# EAGLE design SparkFun_6DoF_ISM330DHCX_Micro (EAGLE 9.6.2)
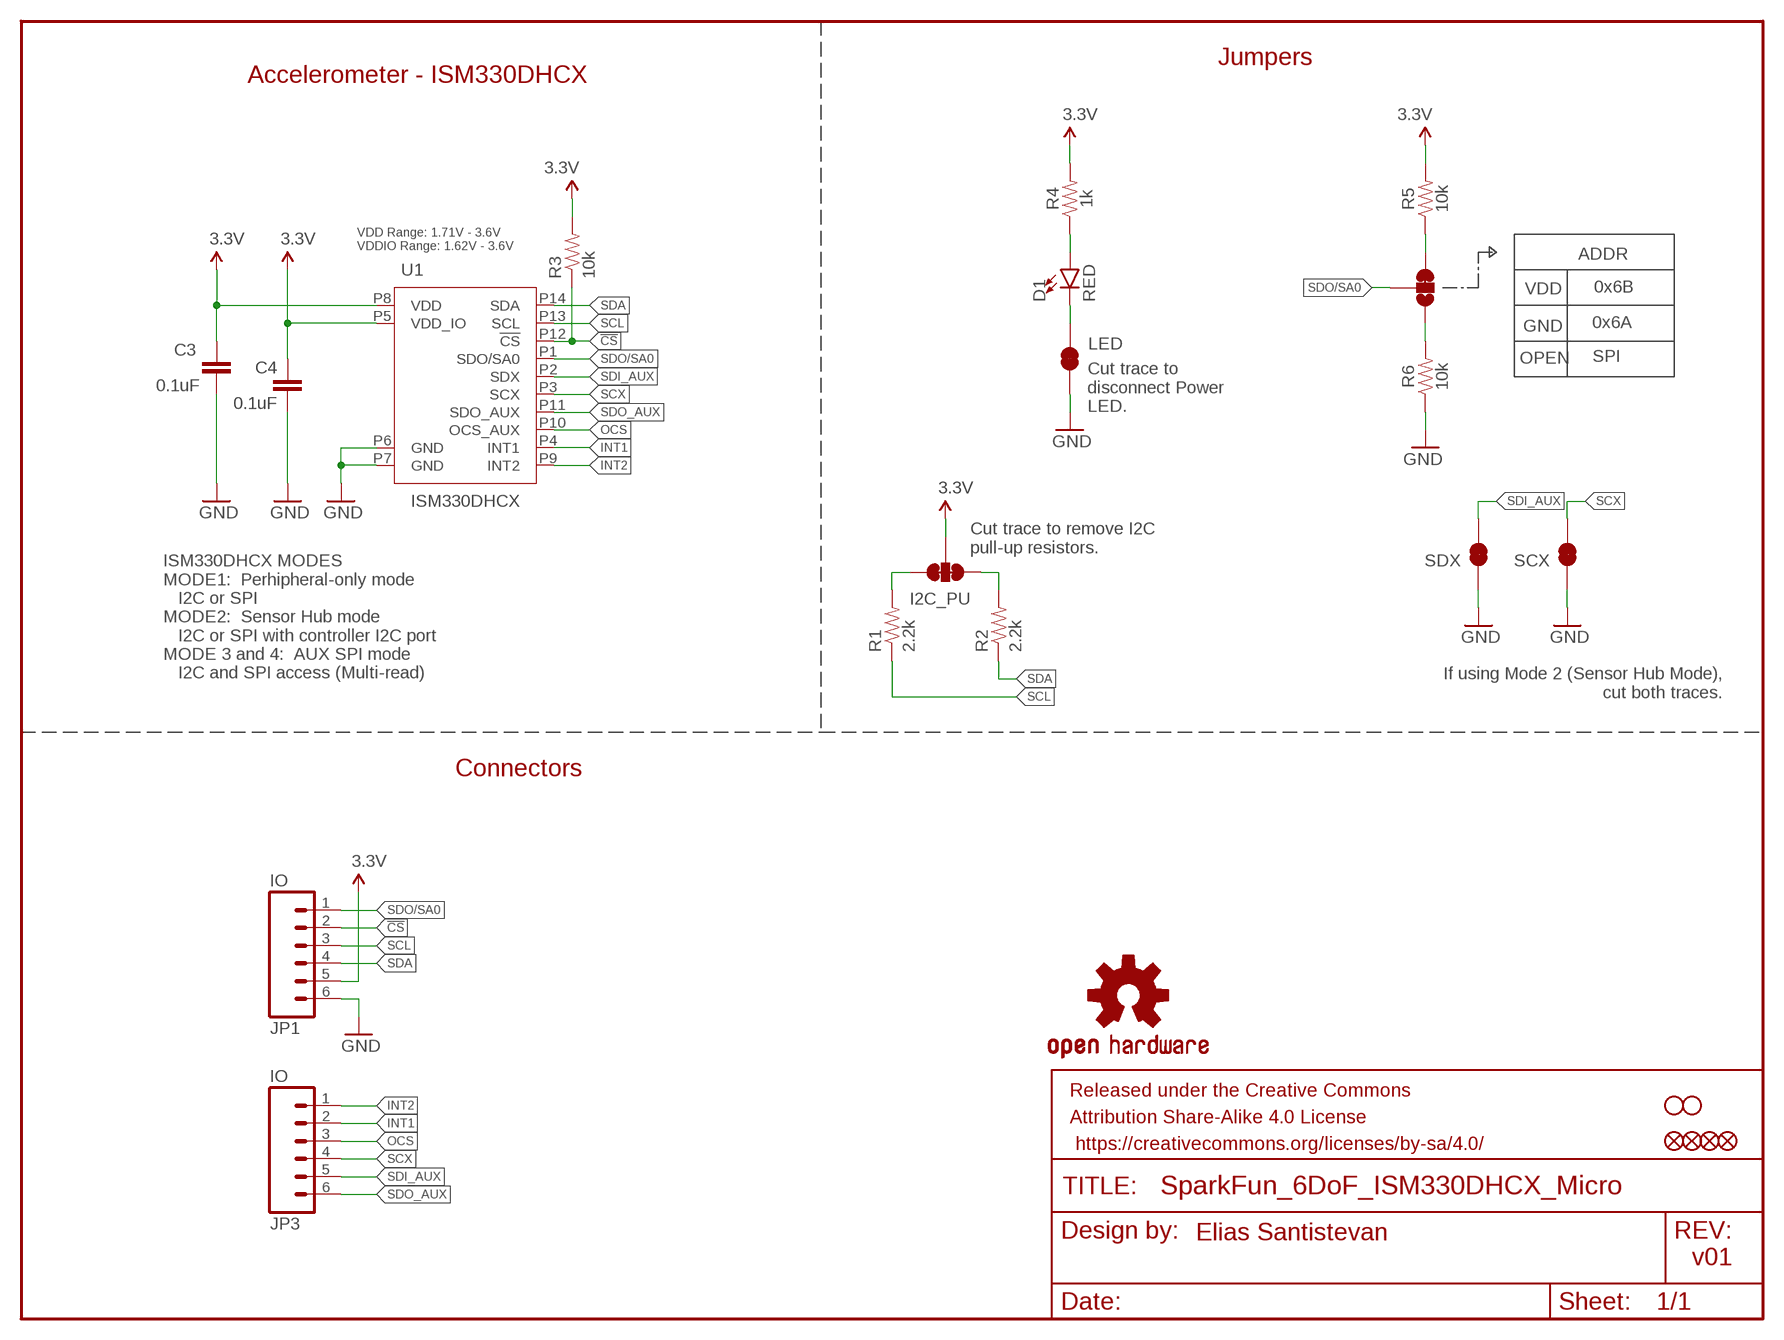
[diagram p0: schematic, sheet 1]

## Parts
ADDR  JUMPER-SMT_3_1-NC_TRACE_SILK  [SMT-JUMPER_3_1-NC_TRACE_SILK]
C3  0.1uF  0.1UF-0402T-6.3V-10%-X7R  [0402-TIGHT]
C4  0.1uF  0.1UF-0402T-6.3V-10%-X7R  [0402-TIGHT]
D1  RED  LED-RED0603  [LED-0603]
FD1  FIDUCIALUFIDUCIAL  [FIDUCIAL-MICRO]
FD2  FIDUCIALUFIDUCIAL  [FIDUCIAL-MICRO]
FID1  FIDUCIALUFIDUCIAL  [FIDUCIAL-MICRO]
FID2  FIDUCIALUFIDUCIAL  [FIDUCIAL-MICRO]
FRAME1  FRAME-LETTER  [CREATIVE_COMMONS]
I2C_PU  S_MODE  JUMPER-SMT_3_2-NC_TRACE_SILK  [SMT-JUMPER_3_2-NC_TRACE_SILK]
JP1  IO  CONN_06NO_SILK_NO_POP  [1X06_NO_SILK]
JP3  IO  CONN_06NO_SILK_NO_POP  [1X06_NO_SILK]
LED  JUMPER-SMT_2_NC_TRACE_SILK  [SMT-JUMPER_2_NC_TRACE_SILK]
LOGO2  OSHW-LOGOMINI  [OSHW-LOGO-MINI]
R1  2.2k  2.2KOHM-0402T-1/16W-1%  [0402-TIGHT]
R2  2.2k  2.2KOHM-0402T-1/16W-1%  [0402-TIGHT]
R3  10k  10KOHM-0402T-1/16W-1%  [0402-TIGHT]
R4  1k  1KOHM-0402T-1/16W-1%  [0402-TIGHT]
R5  10k  10KOHM-0402T-1/16W-1%  [0402-TIGHT]
R6  10k  10KOHM-0402T-1/16W-1%  [0402-TIGHT]
SCX  JUMPER-SMT_2_NC_TRACE_SILK  [SMT-JUMPER_2_NC_TRACE_SILK]
SDX  JUMPER-SMT_2_NC_TRACE_SILK  [SMT-JUMPER_2_NC_TRACE_SILK]
STANDOFF1  STAND-OFFTIGHT  [STAND-OFF-TIGHT]
STANDOFF2  STAND-OFFTIGHT  [STAND-OFF-TIGHT]
U1  ISM330DHCX  [LGA-14L]

## Nets
3.3V: C3.1 C4.1 I2C_PU.2 JP1.5 R3.2 R4.2 R5.2 U1.P5(VDD_IO) U1.P8(VDD)
!CS!: JP1.2 R3.1 U1.P12(!CS!)
GND: C3.2 C4.2 JP1.6 LED.1 R6.1 SCX.1 SDX.1 U1.P6(GND) U1.P7(GND)
INT1: JP3.2 U1.P4(INT1)
INT2: JP3.1 U1.P9(INT2)
N$1: ADDR.3 R5.1
N$2: D1.A R4.1
N$3: D1.C LED.2
N$5: I2C_PU.1 R1.2
N$6: I2C_PU.3 R2.2
N$7: ADDR.1 R6.2
OCS: JP3.3 U1.P10(OCS_AUX)
SCL: JP1.3 R1.1 U1.P13(SCL)
SCX: JP3.4 SCX.2 U1.P3(SCX)
SDA: JP1.4 R2.1 U1.P14(SDA)
SDI_AUX: JP3.5 SDX.2 U1.P2(SDX)
SDO/SA0: ADDR.2 JP1.1 U1.P1(SDO/SA0)
SDO_AUX: JP3.6 U1.P11(SDO_AUX)

## Notes on the sheet
- Jumpers
- Accelerometer - ISM330DHCX
- VDD Range: 1.71V - 3.6V
  VDDIO Range: 1.62V - 3.6V
- VDD | 0x6B
- GND | 0x6A
- OPEN | SPI
- Cut trace to
  disconnect Power
  LED.
- Cut trace to remove I2C
  pull-up resistors.
- ISM330DHCX MODES
  MODE1:  Perhipheral-only mode
     I2C or SPI
  MODE2:  Sensor Hub mode
     I2C or SPI with controller I2C port
  MODE 3 and 4:  AUX SPI mode
     I2C and SPI access (Multi-read)
- If using Mode 2 (Sensor Hub Mode), 
  cut both traces.
- Connectors
- Elias Santistevan
- v01

## Library data of the parts
ADDR = SparkFun-Jumpers:JUMPER-SMT_3_1-NC_TRACE: Normally closed trace jumper (1 of 2 connections) This jumper has a trace between two pads so it's normally closed (NC). The other connection is normally open (NO). Use a razor knife to open the connection. For best results follow the IPC guidelines for cutting traces: Cutout at least 0.063 mm (0.005 in). Remove all loose material to clean up the cut area. Seal the cut with an approved epoxy. Reapply solder to reclose the connection, or to close the NO connection.
C3 C4 = SparkFun-Capacitors:0.1UF: 0.1µF ceramic capacitors A capacitor is a passive two-terminal electrical component used to store electrical energy temporarily in an electric field.; PROD_ID: CAP-14993
D1 = SparkFun-LED:LED-RED: Red SMD LED Used in manufacturing of most products at SparkFun Packages: 0603 - SMD 0603 package [Product Link] <http://docs.avagotech.com/docs/AV02-0551EN> 0603 SMART - SMD 0603 SMART package ( more efficient and expensive)[Product Link] <http://www.osram-os.com/Graphics/XPic2/00077099_0.pdf> 1206 - SMD1206 package [Product Link] <https://www.sparkfun.com/datasheets/DevTools/LilyPad/Q150OVS4.pdff> SparkFun Products: Pro Mini 328 -5V <https://www.sparkfun.com/products/821> RedBoard <https://www.sparkfun.com/products/12757> IOIO-OTG <https://www.sparkfun.com/products/13613>; PROD_ID: DIO-00819
FD1 FD2 FID1 FID2 = SparkFun-Aesthetics:FIDUCIAL: Fiducial Alignment Points Point-of-reference for pick-and-place machines and other optical instruments.
FRAME1 = SparkFun-Aesthetics:FRAME-LETTER: Schematic Frame - Letter Standard 8.5x11 US Letter frame; DESIGNER: Elias Santistevan
I2C_PU = SparkFun-Jumpers:JUMPER-SMT_3_2-NC_TRACE: Normally closed trace jumper (2 of 2 connections) This jumper has a trace between all three pads so they are normally closed (NC). Use a razor knife to open the connection(s). For best results follow the IPC guidelines for cutting traces: Cutout at least 0.063 mm (0.005 in). Remove all loose material to clean up the cut area. Seal the cut with an approved epoxy. Reapply solder to reclose the connection(s).
JP1 JP3 = SparkFun-Connectors:CONN_06: Multi connection point. Often used as Generic Header-pin footprint for 0.1 inch spaced/style header connections On any of the 0.1 inch spaced packages, you can populate with these: Break Away Headers - Straight <https://www.sparkfun.com/products/116> (PRT-00116) Break Away Male Headers - Right Angle <https://www.sparkfun.com/products/553> (PRT-00553) Female Headers <https://www.sparkfun.com/products/115> (PRT-00115) Break Away Headers - Machine Pin <https://www.sparkfun.com/products/117> (PRT-00117) Break Away Female Headers - Swiss Machine Pin <https://www.sparkfun.com/products/743> (PRT-00743) Arduino Stackable Header - 6 Pin <https://www.sparkfun.com/products/9280> (PRT-09280) For SCREWTERMINALS and SPRING TERMINALS visit here: Screw Terimnals on SparkFun.com <https://www.sparkfun.com/search/results?term=Screw+Terminals> (5mm/3.5mm/2.54mm spacing) This device is also useful as a general connection point to wire up your design to another part of your project. Our various solder wires solder well into these plated through hole pads. Hook-Up Wire - Assortment (Stranded, 22 AWG) <https://www.sparkfun.com/products/11375> (PRT-11375) Hook-Up Wire - Assortment (Solid Core, 22 AWG) <https://www.sparkfun.com/products/11367> (PRT-11367) View the entire wire category on our website here <https://www.sparkfun.com/categories/141>
LED SCX SDX = SparkFun-Jumpers:JUMPER-SMT_2_NC_TRACE: Normally closed trace jumper This jumper has a trace between two pads so it's normally closed (NC). Use a razor knife to open the connection. For best results follow the IPC guidelines for cutting traces: Cutout at least 0.063 mm (0.005 in). Remove all loose material to clean up the cut area. Seal the cut with an approved epoxy. Reapply solder to reclose the connection.
LOGO2 = SparkFun-Aesthetics:OSHW-LOGO: Open-Source Hardware (OSHW) Logo This logo indicates the piece of hardware it is found on incorporates a OSHW license and/or adheres to the definition of open source hardware found here: http://freedomdefined.org/OSHW
R1 R2 = SparkFun-Resistors:2.2KOHM: 2.2kΩ resistor A resistor is a passive two-terminal electrical component that implements electrical resistance as a circuit element. Resistors act to reduce current flow, and, at the same time, act to lower voltage levels within circuits. - Wikipedia; PROD_ID: RES-14341
R3 R5 R6 = SparkFun-Resistors:10KOHM: 10kΩ resistor A resistor is a passive two-terminal electrical component that implements electrical resistance as a circuit element. Resistors act to reduce current flow, and, at the same time, act to lower voltage levels within circuits. - Wikipedia; PROD_ID: RES-14241
R4 = SparkFun-Resistors:1KOHM: 1kΩ resistor A resistor is a passive two-terminal electrical component that implements electrical resistance as a circuit element. Resistors act to reduce current flow, and, at the same time, act to lower voltage levels within circuits. - Wikipedia; PROD_ID: RES-14342
STANDOFF1 STANDOFF2 = SparkFun-Hardware:STAND-OFF: Stand Off Drill holes for mechanically mounting via screws, standoffs, etc. Note: Use the keepout ring to avoid running the screw head into surrounding components. Variant Overviews STAND-OFF - Mechanical footprint for a #4 phillips button head screw. STAND-OFF-TIGHT - Mechanical footprint for a #4 phillips button head screw, Example SparkFun Products Screw - Phillips Head (1/4", 4-40, 10 pack) <https://www.sparkfun.com/products/10453> (PRT-10453) Screw - Phillips Head (1/2", 4-40, 10 pack) <https://www.sparkfun.com/products/10452> (PRT-10452) Screw - Phillips Head (3/4", 4-40, 10 pack) <https://www.sparkfun.com/products/10451> (PRT-10451) Screw - Phillips Head (1", 4-40, 10 pack) <https://www.sparkfun.com/products/10450> (PRT-10450)
U1 = ISM330DHCX:ISM330DHCX: ISM330DHCX 6DoF The ISM330DHCX is a system-in-package featuring a high-performance 3D digital accelerometer and 3D digital gyroscope tailored for Industry 4.0 applications.; PROD_ID: SEN-19472

## Board
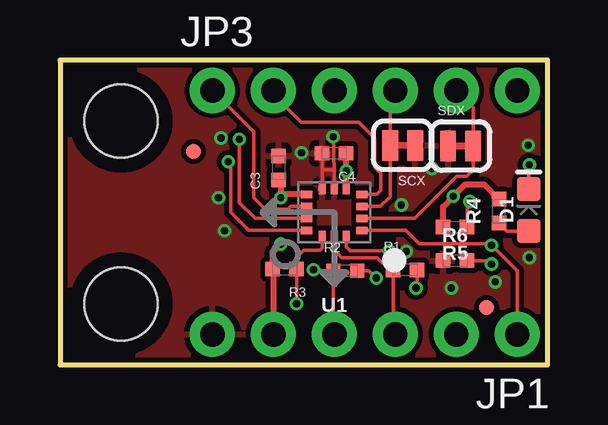
[diagram p1: board, top side]
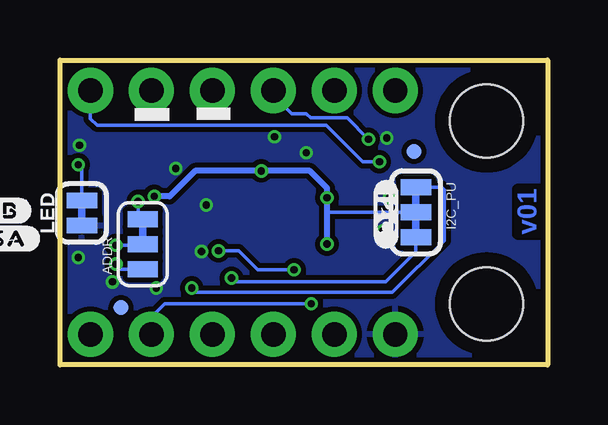
[diagram p2: board, bottom side, seen from below]

Size 20.32 x 12.7 mm. Coordinates in mm from the lower left corner, seen from the top.
Outline: 20.32,12.7 0,12.7 0,0 20.32,0 20.32,12.7
Copper layers (1*16): Top 0.035mm / dielectric 1.5mm / Bottom 0.035mm
Design rules "SparkFun-2-Layer-Minimum-JLCPCB": minimum track width 5mil, minimum drill 0.3mm, track to track 5mil, track to pad 5mil, pad to pad 5mil, via to via 5mil, smd to smd 5mil, copper to edge 7mil, drill to drill 7mil, minimum pad ring 5mil, minimum via ring 5mil, stop-mask expansion 2.5mil, vias tented up to drill 25mil, thermal gap 10mil
tRestrict: area 11.2,7.2 to 11.2,7.4; area 14.7,10 to 16.2,10.2

### Footprints (pad centres in the part's own frame; a part is rotated, then mirrored left to right if it is on the bottom)
SMT-JUMPER_3_1-NC_TRACE_SILK = smd 0.66 x 1.27: 1 -1.041,0; 2 0,0; 3 1.041,0
0402-TIGHT = smd 0.6 x 0.6: 1 -0.5,0; 2 0.5,0
LED-0603 = smd 1 x 1: A -0.877,0; C 0.877,0
FIDUCIAL-MICRO = smd 0.635 x 0.635: 1 0,0
SMT-JUMPER_3_2-NC_TRACE_SILK = smd 0.66 x 1.27: 1 -1.041,0; 2 0,0; 3 1.041,0
1X06_NO_SILK = drill 1.016 pad 1.88: 1 0,0; 2 2.54,0; 3 5.08,0; 4 7.62,0; 5 10.16,0; 6 12.7,0
SMT-JUMPER_2_NC_TRACE_SILK = smd 0.66 x 1.27: 1 -0.521,0; 2 0.521,0
STAND-OFF-TIGHT = hole 3.048: 0,0
LGA-14L = smd 0.48 x 0.3: P1 -1.163,0.75; P2 -1.163,0.25; P3 -1.163,-0.25; P4 -1.163,-0.75; P8 1.163,-0.75; P9 1.163,-0.25; P10 1.163,0.25; P11 1.163,0.75 | smd 0.3 x 0.48: P5 -0.5,-1; P6 0,-1; P7 0.5,-1; P12 0.5,1; P13 0,1; P14 -0.5,1

### Placement (x,y rotation side)
ADDR  16.87,5.03 90 bottom
C3  9.11,8.2 90 top
C4  11.42,8.81 180 top
D1  19.53,6.45 90 top
FD1  5.56,8.89 0 bottom
FD2  17.78,2.39 0 bottom
FID1  5.56,8.89 0 top
FID2  17.78,2.39 0 top
FRAME1  -19.05,-16.51 0 top  (outside the outline)
I2C_PU  5.49,6.35 270 bottom
JP1  19.05,1.27 180 top
JP3  6.35,11.43 0 top
LED  19.41,6.32 90 bottom
LOGO1  QWIIC_LOGO_4MM  [QWIIC_4MM]  32,3.25 0 top  (outside the outline)
LOGO2  31.39,8.36 0 bottom  (outside the outline)
LOGO3  SFE_LOGO_NAME_FLAME.1_INCH  [SFE_LOGO_NAME_FLAME_.1]  -9.85,7.71 270 bottom  (outside the outline)
R1  14.38,3.96 0 top
R2  11.89,3.92 0 top
R3  9.36,3.99 180 top
R4  18.29,6.4 90 top
R5  16.46,5.74 180 top
R6  16.46,4.34 0 top
SCX  14.27,9.14 180 top
SDX  16.69,9.12 0 top
STANDOFF1  2.54,10.16 0 top
STANDOFF2  2.54,2.54 0 top
U1  11.43,6.35 180 top
U$1  [#3V3#1]  26.67,25.55 90 top  (outside the outline)
U$2  [#GND#0]  24.16,25.58 90 top  (outside the outline)
U$3  [##CS##7]  36.86,24.94 90 top  (outside the outline)
U$4  [#SDA#4]  29.21,25.55 90 top  (outside the outline)
U$5  [#SCL#5]  31.78,25.4 90 top  (outside the outline)
U$6  [#SDO#6]  34.32,25.53 90 top  (outside the outline)
U$7  [#INT1#9]  8.86,26.47 90 top  (outside the outline)
U$8  [#INT2#9]  6.32,26.34 90 top  (outside the outline)
U$9  [#OCS#8]  11.43,26.62 90 top  (outside the outline)
U$10  [#SCX#9]  14.02,24.23 90 top  (outside the outline)
U$11  [#SDIX#11]  16.51,23.95 90 top  (outside the outline)
U$12  [ISM330DHCX331]  -8.53,11.99 0 top  (outside the outline)
U$13  [#0X6A#11]  23.11,5.26 0 bottom
U$14  [#0X6B#11]  23.39,6.43 0 bottom  (outside the outline)
U$15  [#3V3#1]  26.67,25.55 270 bottom  (outside the outline)
U$16  [#LED#11]  31.24,11.91 0 bottom  (outside the outline)
U$17  [#GND#0]  24.16,25.58 270 bottom  (outside the outline)
U$18  [#SDO#7]  34.32,25.53 270 bottom  (outside the outline)
U$19  [#INT1#9]  8.86,26.47 270 bottom  (outside the outline)
U$20  [#OCS#7]  11.43,26.62 270 bottom  (outside the outline)
U$21  [#INT2#9]  6.32,26.34 270 bottom  (outside the outline)
U$22  [#SCL#5]  31.78,25.4 270 bottom  (outside the outline)
U$23  [#SCX#8]  14,24.16 270 bottom  (outside the outline)
U$24  [#SDOX#12]  19.02,26.06 90 top  (outside the outline)
U$25  [#I2C#11]  6.73,6.27 270 bottom
U$26  [#SDI#4]  29.21,25.2 270 bottom  (outside the outline)
U$27  [##CS##8]  36.86,24.94 270 bottom  (outside the outline)
U$28  [PWR8]  32.97,12.65 90 top  (outside the outline)
U$29  [SFE_LOGO_FLAME_.1]  32.08,0.89 0 top  (outside the outline)
U$30  [ISM330DHCX20]  -6.45,7.77 270 bottom  (outside the outline)
U$31  [6DOF12]  -8.28,7.77 270 bottom  (outside the outline)
U$32  [#SDOX#12]  19.02,26.09 270 bottom  (outside the outline)
U$33  [#SDIX#11]  16.51,23.9 270 bottom  (outside the outline)

### Tracks (layer width: path | path; a pad name or v marks a point on that pad's centre or on a via)
3.3V  (via drill 0.3)
  Top 0.254: U1.P5 v11.93,8.08 C4.1 | JP1.5 8.89,3.96 R3.2 8.86,4.69 v9.2,5.03 | C3.1 9.2,7.62 9.2,7.11 | 9.2,7.11 v9.2,6.96 | 9.2,7.11 9.21,7.1 U1.P8 | R4.2 17.67,7.52 16.88,7.52 v16.39,7.02 15.96,6.59 R5.2
  Bottom 0.152: I2C_PU.2 9.2,6.35
  Bottom 0.254: v9.2,5.03 9.2,6.35 v9.2,6.96 9.2,7.37 9.91,8.08 v11.93,8.08 14.69,8.08 15.75,7.02 v16.39,7.02
!CS!  (via drill 0.3)
  Top 0.152: U1.P12 10.93,4.88 10.82,4.78 10.16,4.78 9.86,4.47 R3.1 v9.86,2.54
  Bottom 0.152: JP1.2 16.51,1.98 15.95,2.54 v9.86,2.54
GND  (via drill 0.3)
  Top 0.152: U1.P7 10.93,7.62 | 10.93,7.62 10.93,7.73 | U1.P6 11.43,8.13 | 11.38,9.45 11.41,9.41 11.41,8.43 11.43,8.41 11.43,8.13 | 10.93,7.62 10.92,7.63 10.92,8.13 | 10.92,8.13 11.43,8.13 | 10.92,8.13 C4.2
  other vias: 10.06,8.84 6.71,9.45 16.31,3.2 19.51,9.14 15.49,8.18 18.14,3.45 19.56,4.47 6.86,5.59 6.6,6.96 11.38,9.5 14.22,6.65 14.43,4.72
  pour Bottom (isolate 0.203): 20.32,0 20.32,12.7 0,12.7 0,0
  pour Top (isolate 0.203, rank 2): 20.32,0 20.32,12.7 0,12.7 0,0
INT1
  Top 0.152: U1.P4 13.2,7.1 13.36,7.26 13.36,7.98 13.11,8.23 13.11,9.45 12.45,10.11 10.06,10.11 8.89,11.28 JP3.2
INT2
  Top 0.152: U1.P9 9.62,6.6 9.49,6.48 8.56,6.48 8.08,6.96 8.08,9.7 JP3.1
N$1  (via drill 0.3)
  Top 0.152: R5.1 16.96,6.7 v17.07,6.81
  Bottom 0.152: v17.07,6.81 17.07,6.27 ADDR.3
N$2
  Top 0.152: D1.A 18.61,5.57 R4.1
N$3  (via drill 0.3)
  Top 0.152: D1.C 19.53,8.31 v19.56,8.33
  Bottom 0.152: LED.2 19.41,8.18 v19.56,8.33
N$5  (via drill 0.3)
  Top 0.152: v14.83,3.2 14.88,3.24 R1.2
  Bottom 0.152: v14.83,3.2 14.65,3.02 6.47,3.02 4.32,5.17 4.32,7.29 4.42,7.39 I2C_PU.1
N$6  (via drill 0.3)
  Top 0.152: R2.2 12.87,3.92 v13.17,3.61
  Bottom 0.152: v13.17,3.61 13.02,3.46 6.75,3.46 5.49,4.72 I2C_PU.3
N$7  (via drill 0.3)
  Top 0.152: R6.2 17.84,4.34 v17.98,4.2
  Bottom 0.152: v17.98,4.2 17.77,3.99 ADDR.1
OCS  (via drill 0.3)
  Top 0.152: U1.P10 9.51,6.1 8.13,6.1 7.47,6.76 v7.47,9.4
  Bottom 0.152: v7.47,9.4 8.36,10.29 9.87,10.29 10.05,10.46 10.67,10.46 11.43,11.23 JP3.3
SCL
  Top 0.152: JP1.3 13.88,1.36 R1.1 13.73,3.96 13.22,4.47 11.73,4.47 11.43,4.78 U1.P13
SCX
  Top 0.152: JP3.4 13.75,11.21 SCX.2 13.75,7.01 13.34,6.6 U1.P3
SDA  (via drill 0.3)
  Top 0.152: JP1.4 11.39,1.31 R2.1 10.61,3.92 v10.57,3.96 | v13.72,4.75 v13.71,4.75 12.09,4.75 11.93,4.91 U1.P14
  Bottom 0.152: v10.57,3.96 12.09,3.96 12.88,4.75 v13.72,4.75
SDI_AUX
  Top 0.152: U1.P2 14.79,6.1 16.54,7.85 16.94,7.85 17.21,8.12 SDX.2 17.21,10.73 JP3.5
SDO/SA0  (via drill 0.3)
  Top 0.152: U1.P1 14.41,5.6 14.96,5.05 17.91,5.05 v17.98,4.98 19.05,3.91 JP1.1
  Bottom 0.152: v17.98,4.98 16.92,4.98 ADDR.2
SDO_AUX  (via drill 0.3)
  Top 0.152: U1.P11 7.86,5.6 7.11,6.35 7.11,8.36 v7.01,8.46
  Bottom 0.152: v7.01,8.46 7.7,8.46 9.22,9.98 18.77,9.98 19.05,10.26 JP3.6

### Text on the board
Bottom: v01
tPlace: Z | X | Y
bPlace: X | Z | Y